# EAGLE design LaserTester2 (EAGLE 7.6.0)
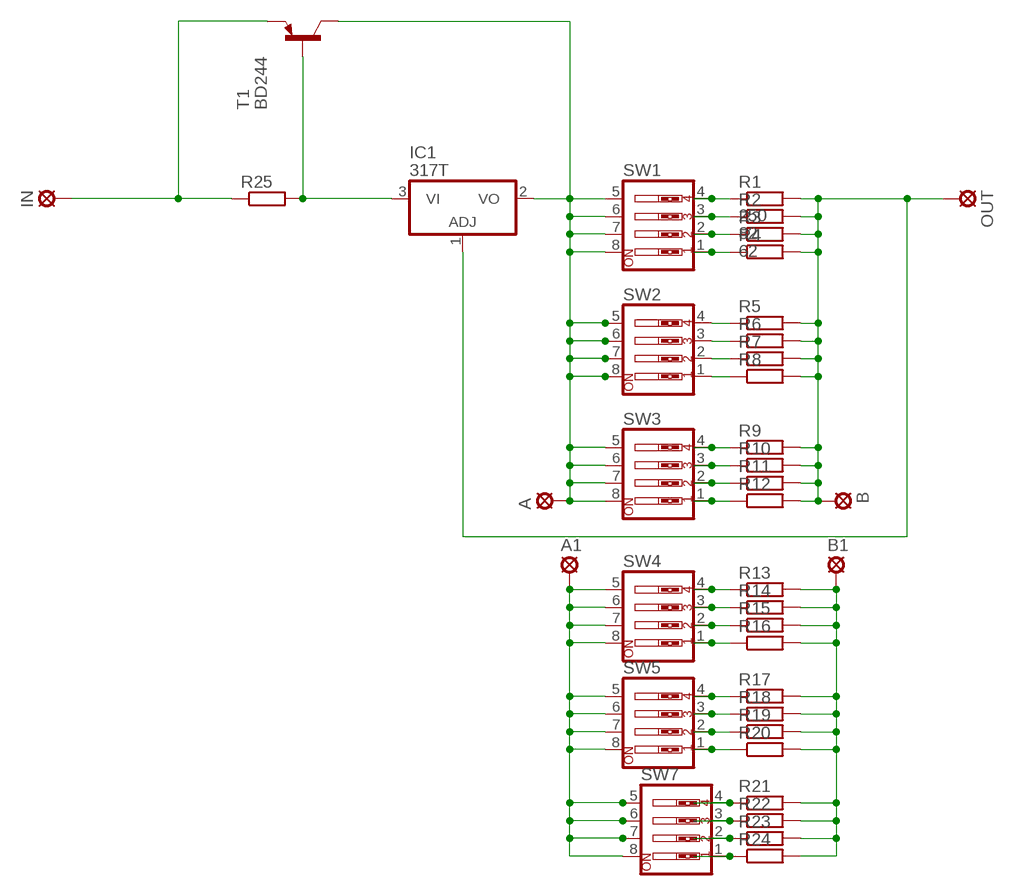
[diagram p0: schematic, sheet 1]

## Parts
A  LSP10  [LSP10]
A1  LSP10  [LSP10]
B  LSP10  [LSP10]
B1  LSP10  [LSP10]
IC1  317T  [TO220H]
IN  LSP10  [LSP10]
OUT  LSP10  [LSP10]
R1  250  R-EU_0207/10  [0207/10]
R2  82  R-EU_0207/10  [0207/10]
R3  62  R-EU_0207/10  [0207/10]
R4  R-EU_0207/10  [0207/10]
R5  R-EU_0207/10  [0207/10]
R6  R-EU_0207/10  [0207/10]
R7  R-EU_0207/10  [0207/10]
R8  R-EU_0207/10  [0207/10]
R9  R-EU_0207/10  [0207/10]
R10  R-EU_0207/10  [0207/10]
R11  R-EU_0207/10  [0207/10]
R12  R-EU_0207/10  [0207/10]
R13  R-EU_0207/10  [0207/10]
R14  R-EU_0207/10  [0207/10]
R15  R-EU_0207/10  [0207/10]
R16  R-EU_0207/10  [0207/10]
R17  R-EU_0207/10  [0207/10]
R18  R-EU_0207/10  [0207/10]
R19  R-EU_0207/10  [0207/10]
R20  R-EU_0207/10  [0207/10]
R21  R-EU_0207/10  [0207/10]
R22  R-EU_0207/10  [0207/10]
R23  R-EU_0207/10  [0207/10]
R24  R-EU_0207/10  [0207/10]
R25  R-EU_0207/10  [0207/10]
SW1  SW_DIP-4  [EDG-04]
SW2  SW_DIP-4  [EDG-04]
SW3  SW_DIP-4  [EDG-04]
SW4  SW_DIP-4  [EDG-04]
SW5  SW_DIP-4  [EDG-04]
SW7  SW_DIP-4  [EDG-04]
T1  BD244  [TO220]

## Nets
N$1: A.MP IC1.2(VO) SW1.5 SW1.6 SW1.7 SW1.8 SW2.5 SW2.6 SW2.7 SW2.8 SW3.5 SW3.6 SW3.7 SW3.8 T1.2(C)
N$2: A1.MP SW4.5 SW4.6 SW4.7 SW4.8 SW5.5 SW5.6 SW5.7 SW5.8 SW7.5 SW7.6 SW7.7 SW7.8
N$3: B1.MP R13.2 R14.2 R15.2 R16.2 R17.2 R18.2 R19.2 R20.2 R21.2 R22.2 R23.2 R24.2
N$4: R13.1 SW4.4
N$5: R14.1 SW4.3
N$6: R15.1 SW4.2
N$7: R16.1 SW4.1
N$8: R17.1 SW5.4
N$9: R18.1 SW5.3
N$10: R19.1 SW5.2
N$11: R20.1 SW5.1
N$12: R21.1 SW7.4
N$13: R22.1 SW7.3
N$14: R23.1 SW7.2
N$15: R24.1 SW7.1
N$16: R5.1 SW2.4
N$17: R6.1 SW2.3
N$18: R7.1 SW2.2
N$19: R8.1 SW2.1
N$20: R9.1 SW3.4
N$21: R10.1 SW3.3
N$22: R11.1 SW3.2
N$23: R12.1 SW3.1
N$24: R1.1 SW1.4
N$25: R2.1 SW1.3
N$26: R3.1 SW1.2
N$27: R4.1 SW1.1
N$30: IC1.3(VI) R25.2 T1.1(B)
N$31: IN.MP R25.1 T1.3(E)
N$32: B.MP IC1.1(ADJ) OUT.MP R1.2 R2.2 R3.2 R4.2 R5.2 R6.2 R7.2 R8.2 R9.2 R10.2 R11.2 R12.2

## Library data of the parts
A A1 B B1 IN OUT = solpad:LSP10: SOLDER PAD drill 1.0 mm, distributor Buerklin, 12H555
IC1 = linear:*317: Positive VOLTAGE REGULATOR
R1-R24 = resistor:R-EU_: RESISTOR, European symbol
R25 = rcl:R-EU_: RESISTOR, European symbol
SW1-SW5 SW7 = special:SW_DIP-4: DIP SWITCH
T1 = transistor:BD244: PNP TRANSISTOR Source: Motorola Semiconductor, Master Selection Guide Q3/95 SG73 REV 8 page 5.5-5

## Board
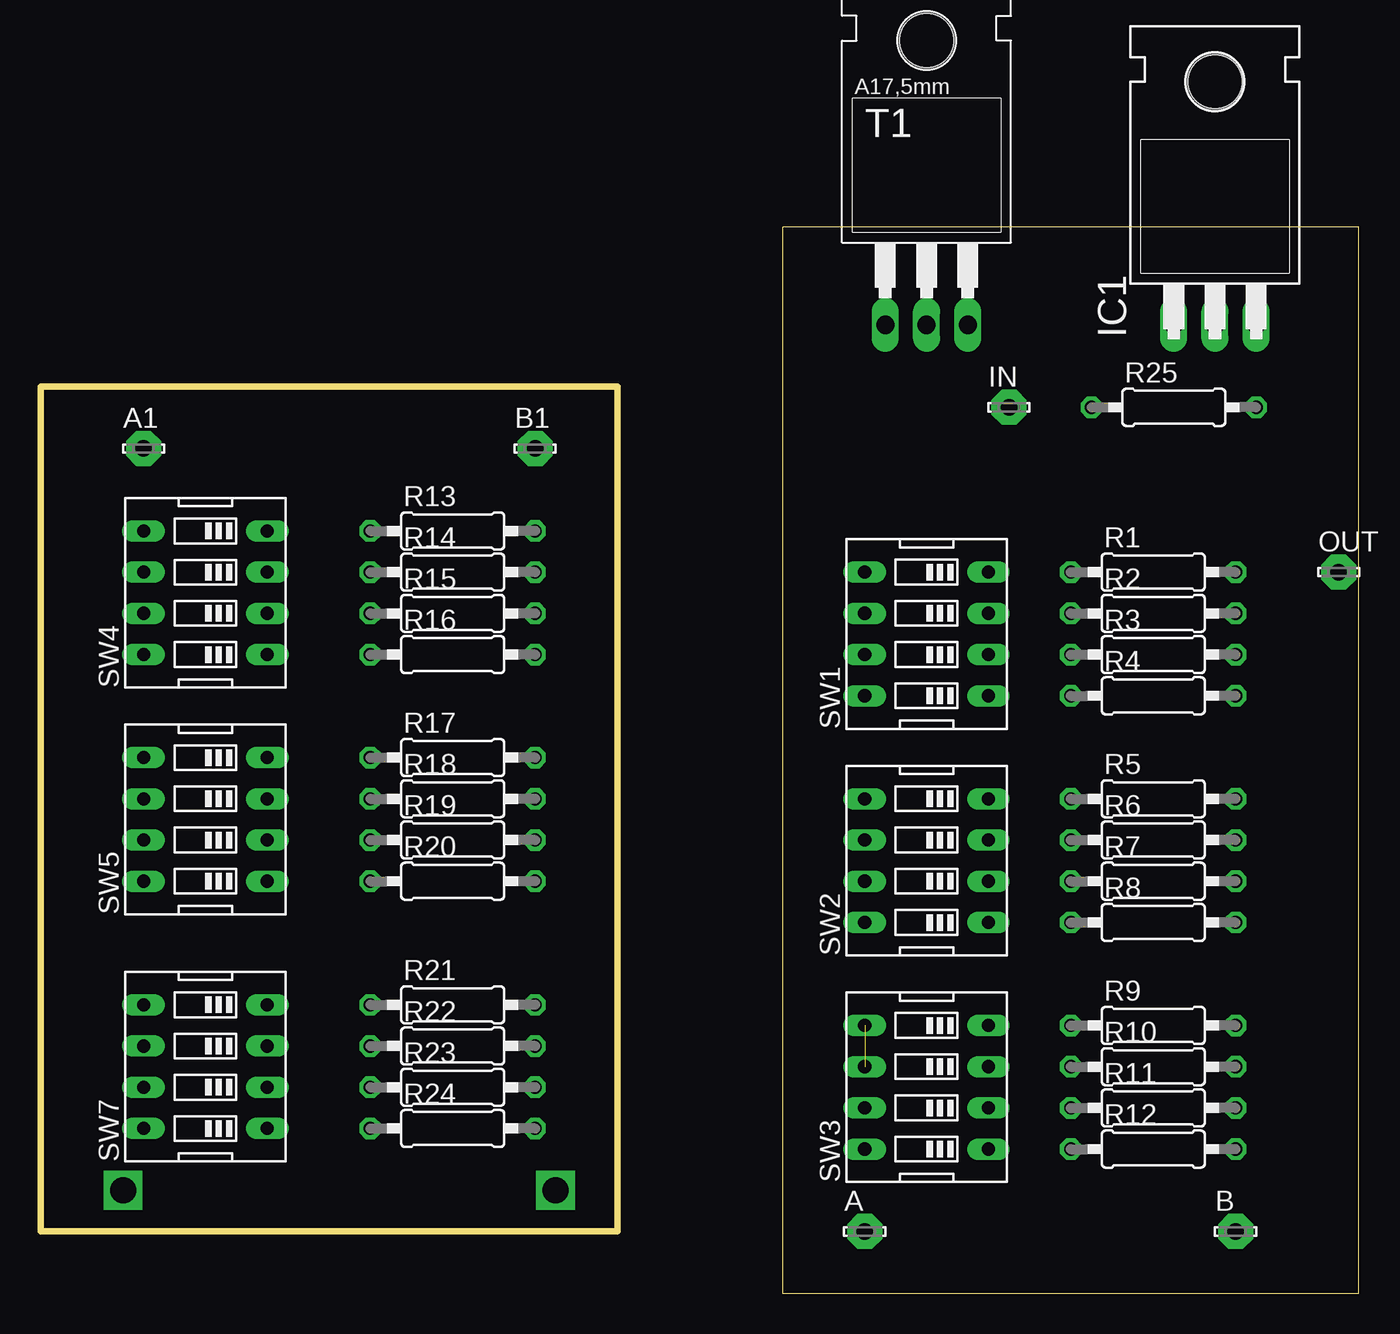
[diagram p1: board, top side]
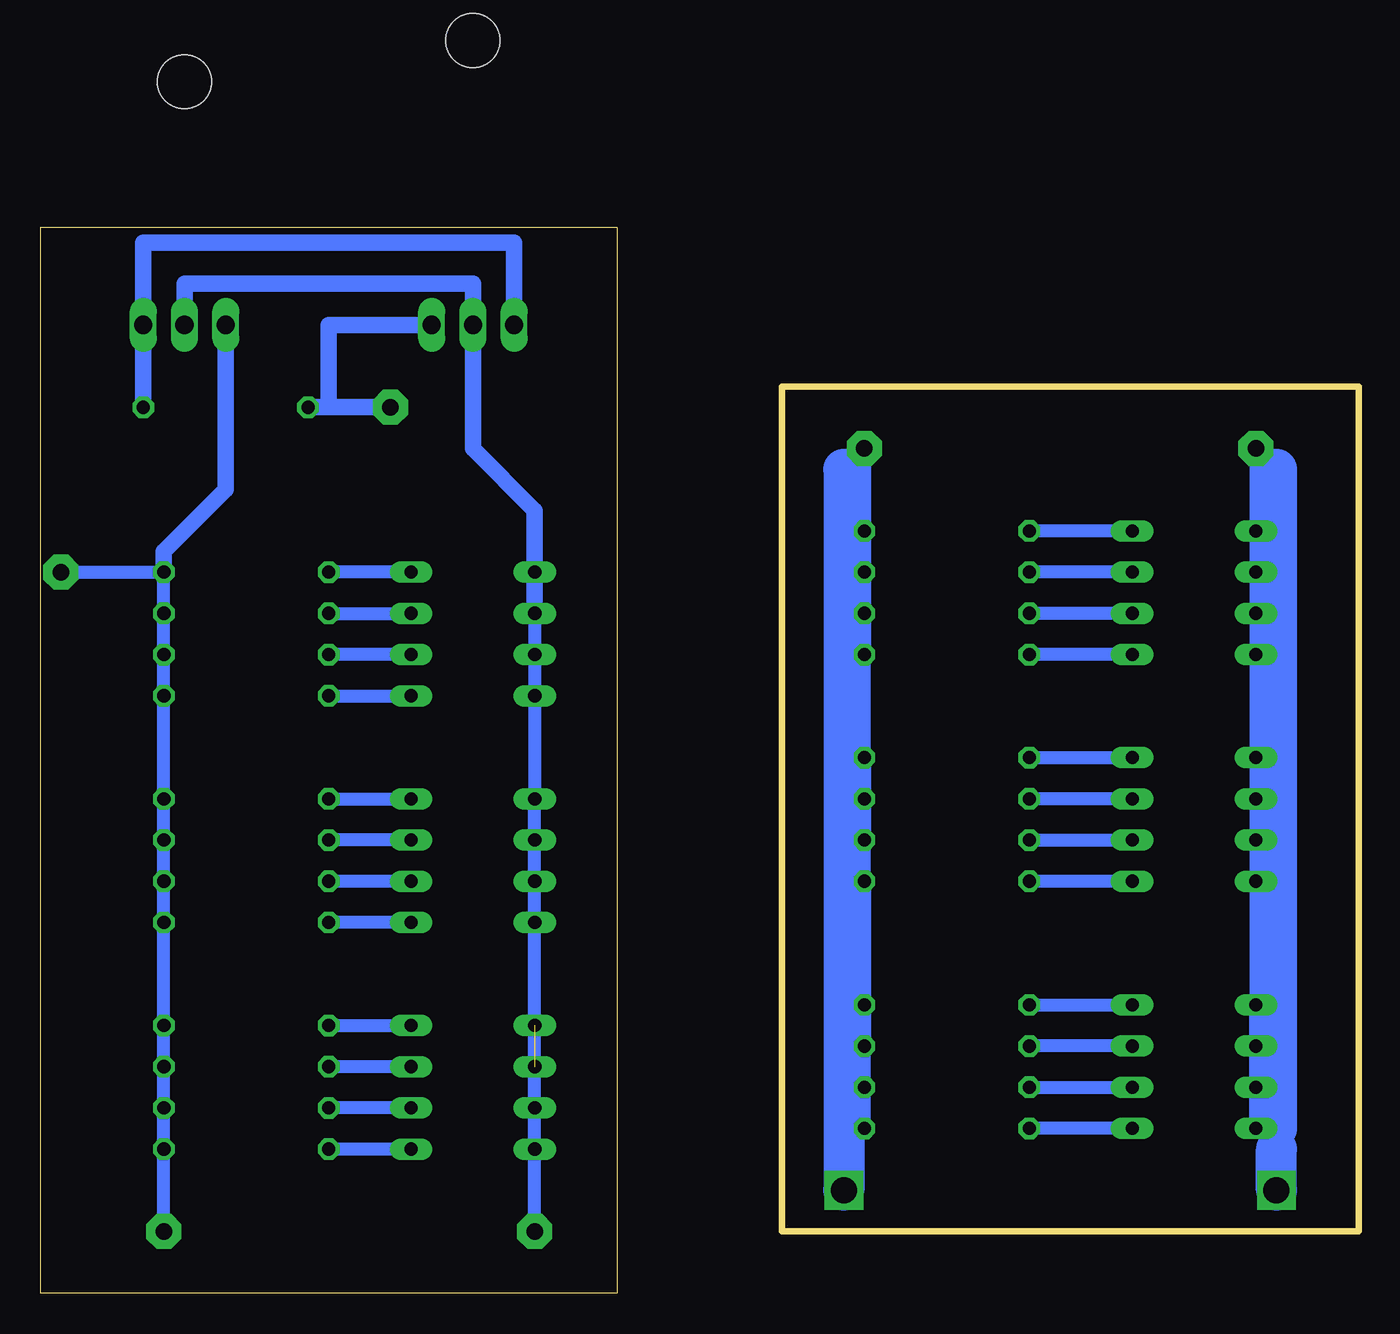
[diagram p2: board, bottom side, seen from below]

Size 81.26 x 65.71 mm. Coordinates in mm from the lower left corner, seen from the top.
Outline: 45.72,0 81.26,0 81.26,65.71 45.72,65.71 45.72,0
Outline: 0,55.88 35.56,55.88 35.56,3.81 0,3.81 0,55.88
Copper layers (1*16): Top 0.035mm / dielectric 1.5mm / Bottom 0.035mm
Design rules "default": minimum track width 10mil, minimum drill 24mil, track to track 8mil, track to pad 8mil, pad to pad 8mil, via to via 8mil, smd to smd 8mil, copper to edge 40mil, drill to drill 8mil, minimum pad ring 10mil, minimum via ring 8mil, stop-mask expansion 4mil, vias tented up to drill 0mil, thermal gap 10mil

### Footprints (pad centres in the part's own frame; a part is rotated, then mirrored left to right if it is on the bottom)
LSP10 = drill 1.016 pad 2.159 octagon: MP 0,0
TO220H = drill 1.118 long: 1 -2.54,-10.16; 2 0,-10.16; 3 2.54,-10.16 | hole 3.302: 0,4.826
0207/10 = drill 0.813 octagon: 1 -5.08,0; 2 5.08,0
EDG-04 = drill 0.813 long: 1 -3.81,-3.81; 2 -1.27,-3.81; 3 1.27,-3.81; 4 3.81,-3.81; 5 3.81,3.81; 6 1.27,3.81; 7 -1.27,3.81; 8 -3.81,3.81
TO220 = drill 1.118 long: 1 -2.54,-6.35; 2 0,-6.35; 3 2.54,-6.35 | hole 3.302: 0,11.176

### Placement (x,y rotation side)
A  50.8,3.81 0 top
A1  6.35,52.07 0 top
B  73.66,3.81 0 top
B1  30.48,52.07 0 top
IC1  72.39,69.85 0 top
IN  59.69,54.61 0 top
OUT  80.01,44.45 0 top
R1  68.58,44.45 0 top
R2  68.58,41.91 0 top
R3  68.58,39.37 0 top
R4  68.58,36.83 0 top
R5  68.58,30.48 0 top
R6  68.58,27.94 0 top
R7  68.58,25.4 0 top
R8  68.58,22.86 0 top
R9  68.58,16.51 0 top
R10  68.58,13.97 0 top
R11  68.58,11.43 0 top
R12  68.58,8.89 0 top
R13  25.4,46.99 0 top
R14  25.4,44.45 0 top
R15  25.4,41.91 0 top
R16  25.4,39.37 0 top
R17  25.4,33.02 0 top
R18  25.4,30.48 0 top
R19  25.4,27.94 0 top
R20  25.4,25.4 0 top
R21  25.4,17.78 0 top
R22  25.4,15.24 0 top
R23  25.4,12.7 0 top
R24  25.4,10.16 0 top
R25  69.85,54.61 0 top
SW1  54.61,40.64 90 top
SW2  54.61,26.67 90 top
SW3  54.61,12.7 90 top
SW4  10.16,43.18 90 top
SW5  10.16,29.21 90 top
SW7  10.16,13.97 90 top
T1  54.61,66.04 0 top

### Tracks (layer width: path | path; a pad name or v marks a point on that pad's centre or on a via)
N$1  (1 unrouted)
  Bottom 0.813: SW1.6 SW1.7 SW1.8 SW2.5 SW2.6 SW2.7 SW2.8 SW3.6 SW3.7 SW3.8 A.MP
  Bottom 1.016: SW1.6 SW1.5 50.8,48.26 54.61,52.07 T1.2 54.61,62.23 72.39,62.23 IC1.2
N$2
  Bottom 0.813: A1.MP SW4.5 SW4.6 SW4.7 SW4.8 SW5.5 SW5.6 SW5.7 SW5.8 SW7.5 | 6.35,16.51 SW7.5 | SW7.5 SW7.6 SW7.7 SW7.8
N$3
  Bottom 0.813: B1.MP R13.2 R14.2 R15.2 R16.2 R17.2 R18.2 R19.2 R20.2 R21.2 R22.2 R23.2 R24.2
N$4
  Bottom 0.813: SW4.4 R13.1
N$5
  Bottom 0.813: SW4.3 R14.1
N$6
  Bottom 0.813: SW4.2 R15.1
N$7
  Bottom 0.813: SW4.1 R16.1
N$8
  Bottom 0.813: R17.1 SW5.4
N$9
  Bottom 0.813: SW5.3 R18.1
N$10
  Bottom 0.813: R19.1 SW5.2
N$11
  Bottom 0.813: SW5.1 R20.1
N$12
  Bottom 0.813: R21.1 SW7.4
N$13
  Bottom 0.813: SW7.3 R22.1
N$14
  Bottom 0.813: R23.1 SW7.2
N$15
  Bottom 0.813: SW7.1 R24.1
N$16
  Bottom 0.813: R5.1 SW2.4
N$17
  Bottom 0.813: SW2.3 R6.1
N$18
  Bottom 0.813: SW2.2 R7.1
N$19
  Bottom 0.813: SW2.1 R8.1
N$20
  Bottom 0.813: R9.1 SW3.4
N$21
  Bottom 0.813: SW3.3 R10.1
N$22
  Bottom 0.813: SW3.2 R11.1
N$23
  Bottom 0.813: SW3.1 R12.1
N$24
  Bottom 0.813: SW1.4 R1.1
N$25
  Bottom 0.813: R2.1 SW1.3
N$26
  Bottom 0.813: SW1.2 R3.1
N$27
  Bottom 0.813: R4.1 SW1.1
N$28
  Bottom 2.54: 5.08,50.8 5.08,10.16
N$29  (via drill 1.6)
  Bottom 2.54: 31.75,50.8 v31.75,6.35
N$30
  Bottom 1.016: T1.1 52.07,64.77 74.93,64.77 IC1.3 R25.2
N$31
  Bottom 1.016: T1.3 63.5,59.69 63.5,54.61 R25.1 IN.MP
N$32
  Bottom 0.813: B.MP R12.2 R11.2 R10.2 R9.2 R8.2 R7.2 R6.2 R5.2 R4.2 R3.2 R2.2 R1.2 OUT.MP
  Bottom 1.016: IC1.1 69.85,49.53 73.66,45.72 R1.2
N$35  (via drill 1.6)
  Bottom 2.54: v5.08,6.35 5.08,8.89